# EAGLE design sensor (EAGLE 8.7.0)
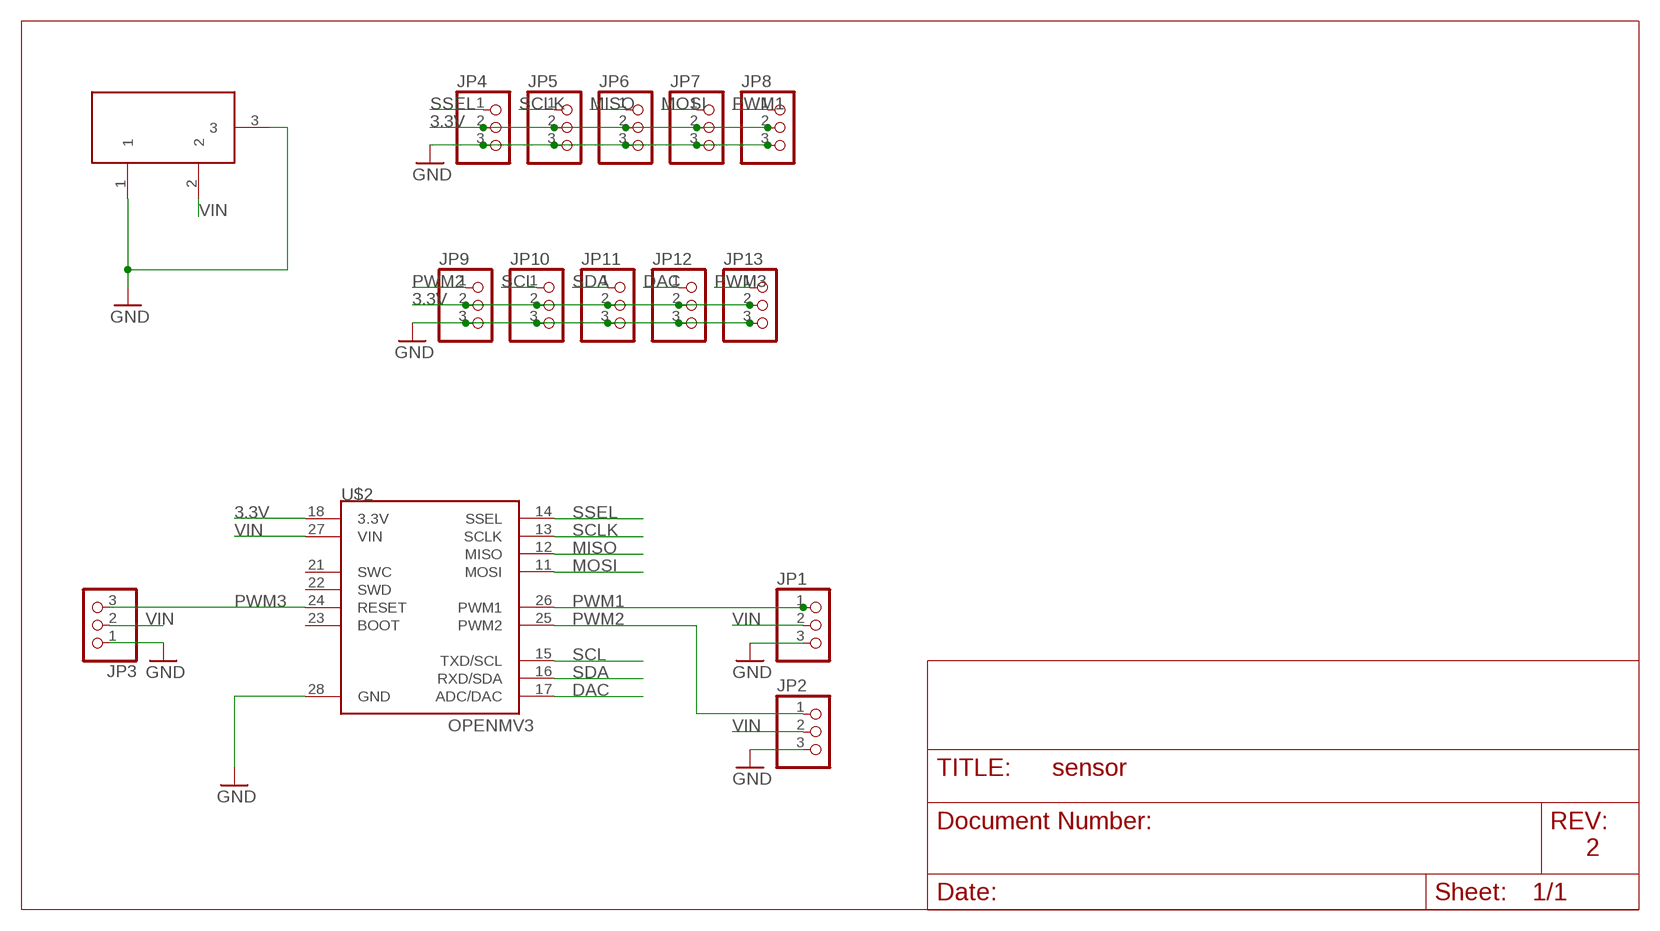
[diagram p0: schematic, sheet 1]

## Parts
JP1  PINHEAD_PINHD-1X3  [PINHEAD_1X03]
JP2  PINHEAD_PINHD-1X3  [PINHEAD_1X03]
JP3  PINHEAD_PINHD-1X3  [PINHEAD_1X03]
JP4  PINHEAD_PINHD-1X3  [PINHEAD_1X03]
JP5  PINHEAD_PINHD-1X3  [PINHEAD_1X03]
JP6  PINHEAD_PINHD-1X3  [PINHEAD_1X03]
JP7  PINHEAD_PINHD-1X3  [PINHEAD_1X03]
JP8  PINHEAD_PINHD-1X3  [PINHEAD_1X03]
JP9  PINHEAD_PINHD-1X3  [PINHEAD_1X03]
JP10  PINHEAD_PINHD-1X3  [PINHEAD_1X03]
JP11  PINHEAD_PINHD-1X3  [PINHEAD_1X03]
JP12  PINHEAD_PINHD-1X3  [PINHEAD_1X03]
JP13  PINHEAD_PINHD-1X3  [PINHEAD_1X03]
U$2  OPENMV3  [OPENMV3]
X1  DC21MMX  [DC-21MM]

## Nets
3.3V: JP4.2 JP5.2 JP6.2 JP7.2 JP8.2 JP9.2 JP10.2 JP11.2 JP12.2 JP13.2 U$2.18(3.3V)
DAC: JP12.1 U$2.17(ADC/DAC)
GND: JP1.3 JP2.3 JP3.1 JP4.3 JP5.3 JP6.3 JP7.3 JP8.3 JP9.3 JP10.3 JP11.3 JP12.3 JP13.3 U$2.28(GND) X1.1 X1.3
MISO: JP6.1 U$2.12(MISO)
MOSI: JP7.1 U$2.11(MOSI)
PWM1: JP1.1 JP8.1 U$2.26(PWM1)
PWM2: JP2.1 JP9.1 U$2.25(PWM2)
PWM3: JP3.3 JP13.1 U$2.24(RESET)
SCL: JP10.1 U$2.15(TXD/SCL)
SCLK: JP5.1 U$2.13(SCLK)
SDA: JP11.1 U$2.16(RXD/SDA)
SSEL: JP4.1 U$2.14(SSEL)
VIN: JP1.2 JP2.2 JP3.2 U$2.27(VIN) X1.2
Unconnected: U$2.21(SWC) U$2.22(SWD) U$2.23(BOOT)

## Notes on the sheet
- 2

## Library data of the parts
JP1-JP13 = proto:PINHEAD_PINHD-1X3: PIN HEADER
U$2 = openmv:OPENMV3
X1 = powersupply:DC21MM

## Net classes
1 vcc: width 1.016 mm, clearance 0.203 mm
2 antenna: width 0.363 mm, clearance 0.305 mm
3 1.8v: width 0.457 mm, clearance 0.254 mm

## Board
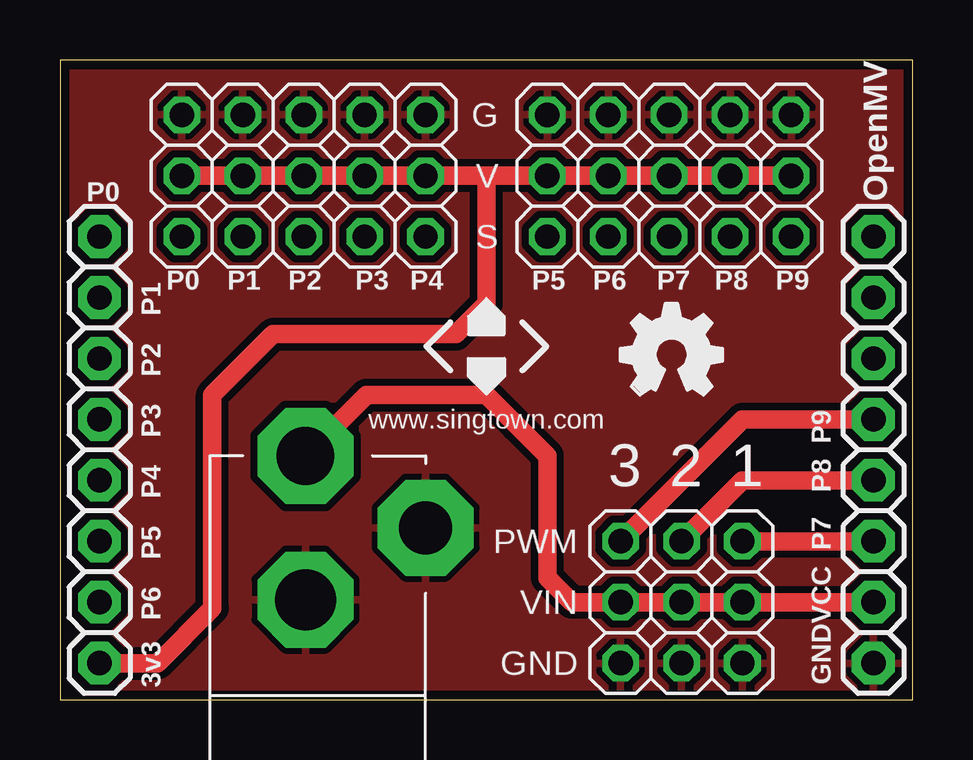
[diagram p1: board, top side]
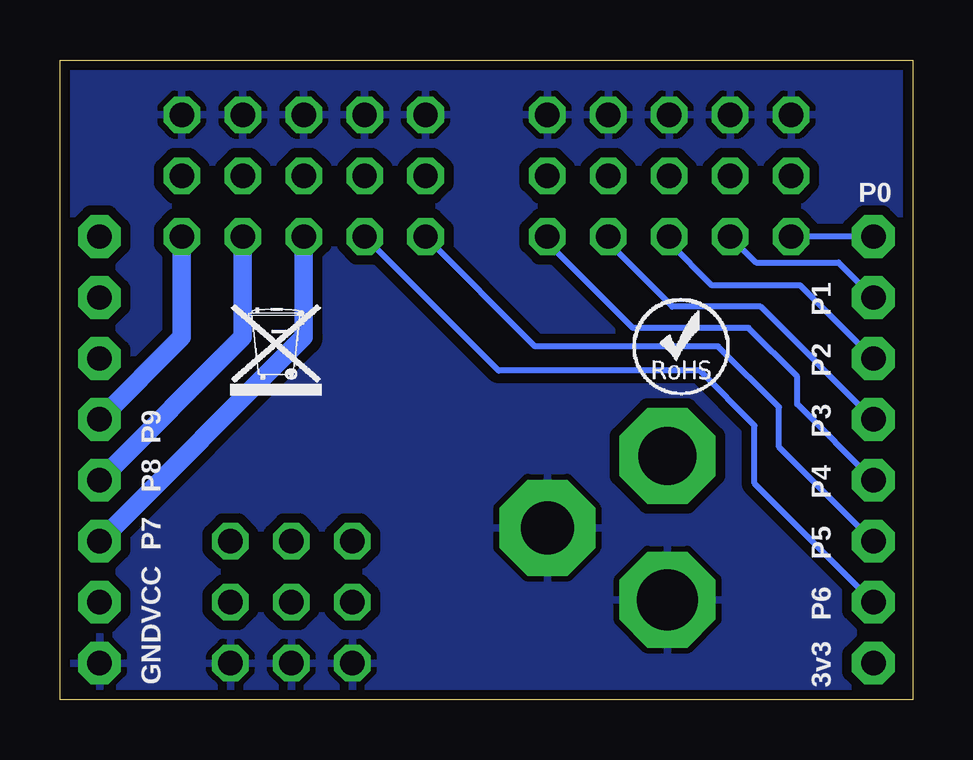
[diagram p2: board, bottom side, seen from below]

Size 35.56 x 26.67 mm. Coordinates in mm from the lower left corner, seen from the top.
Outline: 0,0 35.56,0 35.56,26.67 0,26.67 0,0
Copper layers (1*16): Top 0.0356mm / dielectric 1.5011mm / Bottom 0.0356mm
Design rules "default": minimum track width 6mil, minimum drill 13mil, track to track 6mil, track to pad 6mil, pad to pad 6mil, via to via 6mil, smd to smd 6mil, copper to edge 15mil, drill to drill 6mil, minimum pad ring 7mil, minimum via ring 7mil, stop-mask expansion 3mil, vias tented up to drill 30mil, thermal gap 10mil

### Footprints (pad centres in the part's own frame; a part is rotated, then mirrored left to right if it is on the bottom)
PINHEAD_1X03 = drill 1.016 octagon: 1 -2.54,0; 2 0,0; 3 2.54,0
OPENMV3 = drill 1.016 pad 1.778 octagon: 11 1.651,19.304; 12 1.651,16.764; 13 1.651,14.224; 14 1.651,11.684; 15 1.651,9.144; 16 1.651,6.604; 17 1.651,4.064; 18 1.651,1.524; 21 33.909,19.304; 22 33.909,16.764; 23 33.909,14.224; 24 33.909,11.684; 25 33.909,9.144; 26 33.909,6.604; 27 33.909,4.064; 28 33.909,1.524
DC-21MM = drill 2.2 pad 4 octagon: 1 -5.08,-3.353 | drill 2.4 pad 4 octagon: 2 -0.076,-6.35 | drill 2.54 pad 4 octagon: 3 -0.076,-0.356

### Placement (x,y rotation side)
JP1  28.45,4.06 270 top
JP2  25.91,4.06 270 top
JP3  23.37,4.06 90 top
JP4  12.7,21.84 90 top
JP5  10.16,21.84 90 top
JP6  7.62,21.84 90 top
JP7  5.08,21.84 90 top
JP8  25.4,21.84 90 top
JP9  27.94,21.84 90 top
JP10  15.24,21.84 90 top
JP11  20.32,21.84 90 top
JP12  22.86,21.84 90 top
JP13  30.48,21.84 90 top
U$1  [OSHW_FILLX150_NOTEXT]  23.37,12.7 0 top
U$2  0,0 0 top
U$3  [ROHS]  11.68,12.7 0 bottom
U$4  [WEEE]  28.45,12.7 0 bottom
U$8  SINGTOWN_LOGO  [SINGTOWN_5MM]  17.78,14.73 0 top
X1  10.16,3.81 180 top

### Tracks (layer width: path | path; a pad name or v marks a point on that pad's centre or on a via)
3.3V
  Top 0.762: JP13.2 JP9.2 JP8.2 JP12.2 JP11.2 17.78,21.84 | 17.78,21.84 JP10.2 JP4.2 JP5.2 JP6.2 JP7.2 | U$2.18 4.06,1.52 6.35,3.81 6.35,12.7 8.89,15.24 16.51,15.24 17.78,16.51 17.78,21.84
DAC
  Bottom 0.254: JP12.1 17.27,13.72 8.89,13.72 6.6,11.43 6.6,9.02 U$2.17
GND
  pour Bottom (isolate 0.406, rank 2): 0,0 35.56,0 35.56,26.67 0,26.67
  pour Top (isolate 0.305, rank 2): 0,0 35.56,0 35.56,26.67 0,26.67
MISO
  Bottom 0.254: U$2.12 3.11,18.22 6.54,18.22 JP6.1
MOSI
  Bottom 0.254: U$2.11 JP7.1
PWM1
  Top 0.762: U$2.26 JP1.1
  Bottom 0.762: U$2.26 25.4,15.11 JP8.1
PWM2
  Top 0.762: U$2.25 28.45,9.14 JP2.1
  Bottom 0.762: U$2.25 27.94,15.11 JP9.1
PWM3
  Top 0.762: U$2.24 28.45,11.68 JP3.3
  Bottom 0.762: U$2.24 30.48,15.11 JP13.1
SCL
  Bottom 0.254: JP10.1 15.24,19.05 11.68,15.49 6.86,15.49 4.83,13.46 4.83,12.32 U$2.15
SCLK
  Bottom 0.254: JP5.1 10.16,19.05 8.38,17.27 4.7,17.27 U$2.13
SDA
  Bottom 0.254: JP11.1 15.75,14.73 8.13,14.73 5.59,12.19 5.59,10.54 U$2.16
SSEL
  Bottom 0.254: JP4.1 12.7,19.05 10.03,16.38 6.35,16.38 U$2.14
VIN
  Top 0.762: U$2.27 JP1.2 JP2.2 JP3.2 21.34,4.06 20.32,5.08 20.32,10.16 19.05,11.43 17.78,12.7 12.78,12.7 X1.2

### Text on the board
tPlace: G | P0 | V | OpenMV | S | P0 | P1 | P2 | P3 | P4 | P5 | P6 | P7 | P8 | P9 | P1 | P2 | P3 | www.singtown.com | P9 | 3 | 2 | 1 | P8 | P4 | PWM | P5 | P7 | VIN | P6 | VCC | GND | 3v3 | GND
bPlace: P0 | P1 | P2 | P3 | P9 | P8 | P4 | P5 | P7 | P6 | VCC | 3v3 | GND